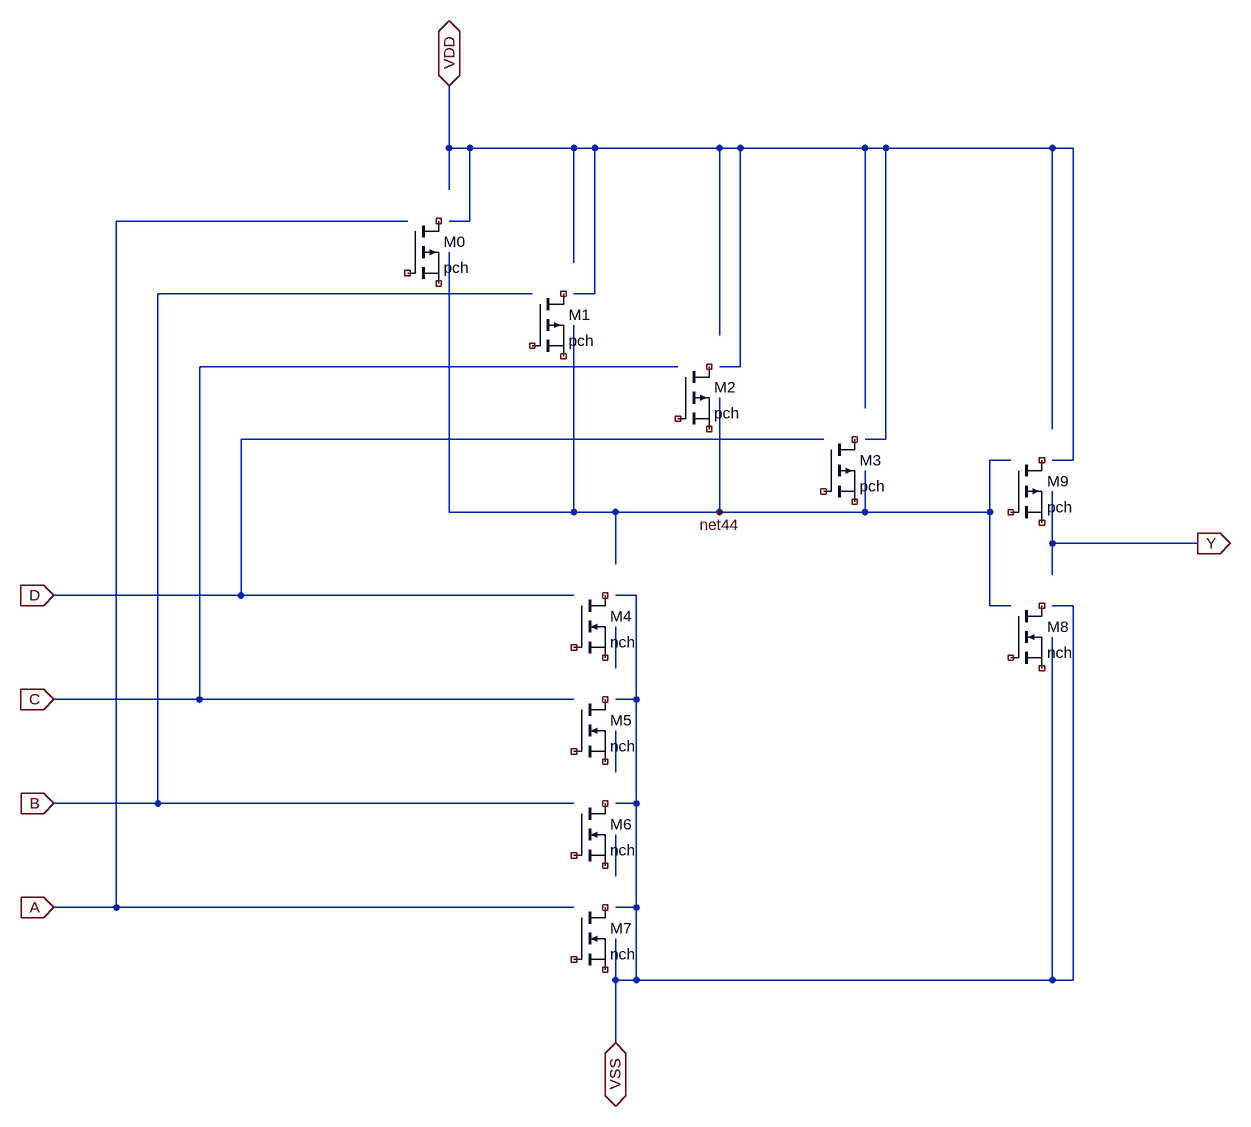
[diagram p0: schematic an41.asc]
an41.asc, the LTspice schematic file:
Version 4
SHEET 1 1936 1664
WIRE 1120 752 1120 576
WIRE 1120 752 1344 752
WIRE 896 752 896 464
WIRE 896 752 960 752
WIRE 1344 752 1536 752
WIRE 1536 752 1536 672
WIRE 1536 896 1568 896
WIRE 1536 896 1536 752
WIRE 1536 672 1568 672
WIRE 960 832 960 752
WIRE 960 752 1120 752
WIRE 1344 752 1344 688
WIRE 704 752 896 752
WIRE 704 752 704 352
WIRE 192 1360 896 1360
WIRE 192 304 640 304
WIRE 192 1360 192 304
WIRE 96 1360 192 1360
WIRE 960 992 960 928
WIRE 960 1152 960 1088
WIRE 320 1040 896 1040
WIRE 320 528 1056 528
WIRE 96 1040 320 1040
WIRE 320 1040 320 528
WIRE 960 1312 960 1248
WIRE 704 96 704 192
WIRE 1632 192 1664 192
WIRE 1664 672 1664 192
WIRE 1632 672 1664 672
WIRE 1632 624 1632 192
WIRE 1376 192 1632 192
WIRE 1344 192 1376 192
WIRE 1376 640 1376 192
WIRE 1344 640 1376 640
WIRE 1152 528 1152 192
WIRE 1152 192 1344 192
WIRE 1120 528 1152 528
WIRE 928 416 928 192
WIRE 928 192 1120 192
WIRE 896 416 928 416
WIRE 736 304 736 192
WIRE 736 192 896 192
WIRE 704 304 736 304
WIRE 896 368 896 192
WIRE 896 192 928 192
WIRE 1120 480 1120 192
WIRE 1120 192 1152 192
WIRE 1344 592 1344 192
WIRE 704 192 736 192
WIRE 704 256 704 192
WIRE 256 416 832 416
WIRE 256 1200 256 416
WIRE 256 1200 896 1200
WIRE 96 1200 256 1200
WIRE 1632 800 1856 800
WIRE 1632 800 1632 720
WIRE 1632 848 1632 800
WIRE 1632 1472 1664 1472
WIRE 1632 896 1664 896
WIRE 1664 1472 1664 896
WIRE 1632 1472 1632 944
WIRE 992 1472 1632 1472
WIRE 960 1568 960 1472
WIRE 960 1360 992 1360
WIRE 992 1360 992 1200
WIRE 960 1200 992 1200
WIRE 992 1200 992 1040
WIRE 960 1040 992 1040
WIRE 992 1040 992 880
WIRE 960 880 992 880
WIRE 960 1472 992 1472
WIRE 992 1472 992 1360
WIRE 960 1472 960 1408
WIRE 384 640 1280 640
WIRE 384 880 384 640
WIRE 384 880 896 880
WIRE 96 880 384 880
FLAG 1120 752 net44
SYMBOL NMOS 1568 896 R0
SYMATTR InstName M8
SYMATTR Value nch
SYMATTR Value2 w=2u l=1u
SYMBOL NMOS 896 1360 R0
SYMATTR InstName M7
SYMATTR Value nch
SYMATTR Value2 w=6.2u l=1u
SYMBOL NMOS 896 1200 R0
SYMATTR InstName M6
SYMATTR Value nch
SYMATTR Value2 w=6.2u l=1u
SYMBOL NMOS 896 1040 R0
SYMATTR InstName M5
SYMATTR Value nch
SYMATTR Value2 w=6.2u l=1u
SYMBOL NMOS 896 880 R0
SYMATTR InstName M4
SYMATTR Value nch
SYMATTR Value2 w=6.2u l=1u
SYMBOL PMOS 1568 672 R0
SYMATTR InstName M9
SYMATTR Value pch
SYMATTR Value2 w=6u l=1u
SYMBOL PMOS 1280 640 R0
SYMATTR InstName M3
SYMATTR Value pch
SYMATTR Value2 w=6u l=1u
SYMBOL PMOS 1056 528 R0
SYMATTR InstName M2
SYMATTR Value pch
SYMATTR Value2 w=6u l=1u
SYMBOL PMOS 832 416 R0
SYMATTR InstName M1
SYMATTR Value pch
SYMATTR Value2 w=6u l=1u
SYMBOL PMOS 640 304 R0
SYMATTR InstName M0
SYMATTR Value pch
SYMATTR Value2 w=6u l=1u
FLAG 1856 800 Y
IOPIN 1856 800 Out
FLAG 960 1568 VSS
IOPIN 960 1568 BiDir
FLAG 704 96 VDD
IOPIN 704 96 BiDir
FLAG 96 880 D
IOPIN 96 880 In
FLAG 96 1040 C
IOPIN 96 1040 In
FLAG 96 1200 B
IOPIN 96 1200 In
FLAG 96 1360 A
IOPIN 96 1360 In

The netlist it stands for:
* an41.asc
* M8: nch w=2u l=1u (symbol NMOS not certain, pin order unknown); nets seen at it: 
* M7: nch w=6.2u l=1u (symbol NMOS not certain, pin order unknown); nets seen at it: 
* M6: nch w=6.2u l=1u (symbol NMOS not certain, pin order unknown); nets seen at it: 
* M5: nch w=6.2u l=1u (symbol NMOS not certain, pin order unknown); nets seen at it: 
* M4: nch w=6.2u l=1u (symbol NMOS not certain, pin order unknown); nets seen at it: 
* M9: pch w=6u l=1u (symbol PMOS not certain, pin order unknown); nets seen at it: 
* M3: pch w=6u l=1u (symbol PMOS not certain, pin order unknown); nets seen at it: 
* M2: pch w=6u l=1u (symbol PMOS not certain, pin order unknown); nets seen at it: 
* M1: pch w=6u l=1u (symbol PMOS not certain, pin order unknown); nets seen at it: 
* M0: pch w=6u l=1u (symbol PMOS not certain, pin order unknown); nets seen at it: 
.backanno
.end